# EAGLE design breakout_board (EAGLE 9.5.2)
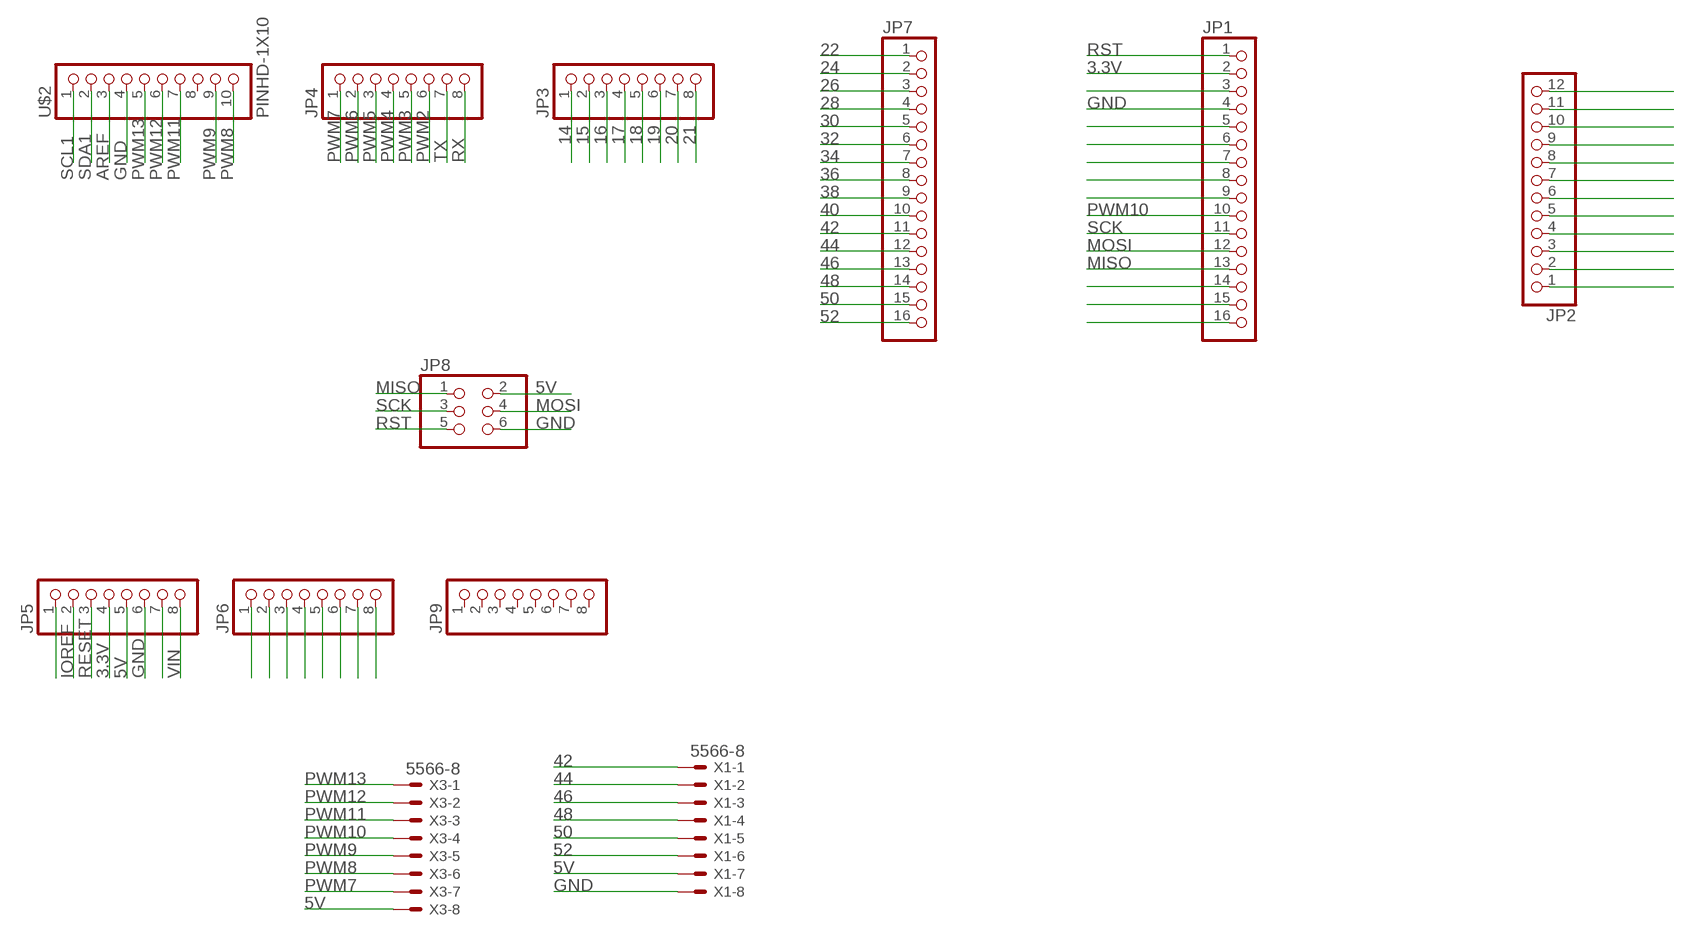
[diagram p0: schematic, sheet 1]

## Parts
JP1  PINHD-1X16  [1X16]
JP2  PINHD-1X12  [1X12]
JP3  PINHD-1X8BIG  [1X08-BIG]
JP4  PINHD-1X8BIG  [1X08-BIG]
JP5  PINHD-1X8BIG  [1X08-BIG]
JP6  PINHD-1X8BIG  [1X08-BIG]
JP7  PINHD-1X16  [1X16]
JP8  PINHD-2X3  [2X03]
JP9  PINHD-1X8BIG  [1X08-BIG]
U$2  PINHD-1X10  [1X10-BIG]
X1  5566-8  [5566-8]
X3  5566-8  [5566-8]

## Nets
3.3V: JP1.2 JP5.4
5V: JP5.5 JP8.2 X1.7 X3.8
14: JP3.1
15: JP3.2
16: JP3.3
17: JP3.4
18: JP3.5
19: JP3.6
20: JP3.7
21: JP3.8
22: JP7.1
24: JP7.2
26: JP7.3
28: JP7.4
30: JP7.5
32: JP7.6
34: JP7.7
36: JP7.8
38: JP7.9
40: JP7.10
42: JP7.11 X1.1
44: JP7.12 X1.2
46: JP7.13 X1.3
48: JP7.14 X1.4
50: JP7.15 X1.5
52: JP7.16 X1.6
AREF: U$2.3
GND: JP1.4 JP5.6 JP8.6 U$2.4 X1.8
IOREF: JP5.2
MISO: JP1.13 JP8.1
MOSI: JP1.12 JP8.4
N$1: JP5.1
N$3: JP2.12
N$4: JP2.11
N$5: JP2.10
N$6: JP2.9
N$7: JP5.7
N$8: JP2.8
N$9: JP6.1
N$10: JP6.2
N$11: JP6.3
N$12: JP6.4
N$13: JP6.5
N$14: JP6.6
N$15: JP6.7
N$16: JP6.8
N$26: JP2.7
N$27: JP2.6
N$28: JP2.5
N$29: JP2.4
N$30: JP2.3
N$31: JP2.2
N$32: JP2.1
N$35: JP1.3
N$37: JP1.5
N$38: JP1.6
N$39: JP1.7
N$40: JP1.8
N$41: JP1.9
N$46: JP1.14
N$47: JP1.15
N$48: JP1.16
PWM2: JP4.6
PWM3: JP4.5
PWM4: JP4.4
PWM5: JP4.3
PWM6: JP4.2
PWM7: JP4.1 X3.7
PWM8: U$2.10 X3.6
PWM9: U$2.9 X3.5
PWM10: JP1.10 X3.4
PWM11: U$2.7 X3.3
PWM12: U$2.6 X3.2
PWM13: U$2.5 X3.1
RESET: JP5.3
RST: JP1.1 JP8.5
RX: JP4.8
SCK: JP1.11 JP8.3
SCL1: U$2.1
SDA1: U$2.2
TX: JP4.7
VIN: JP5.8
Unconnected: JP9.1 JP9.2 JP9.3 JP9.4 JP9.5 JP9.6 JP9.7 JP9.8 U$2.8

## Library data of the parts
JP1 JP7 = pinhead:PINHD-1X16: PIN HEADER
JP2 = pinhead:PINHD-1X12: PIN HEADER
JP3-JP6 JP9 = adafruit:PINHD-1X8: PIN HEADER
JP8 = pinhead:PINHD-2X3: PIN HEADER
U$2 = adafruit:PINHD-1X10: Pin header 1x10 0.1" spacing With round pins
X1 X3 = con-molex:5566-8: Mini FIT connector 8 pol Source: http://www.molex.com; MF: MOLEX; OC_FARNELL: unknown; OC_NEWARK: unknown

## Board
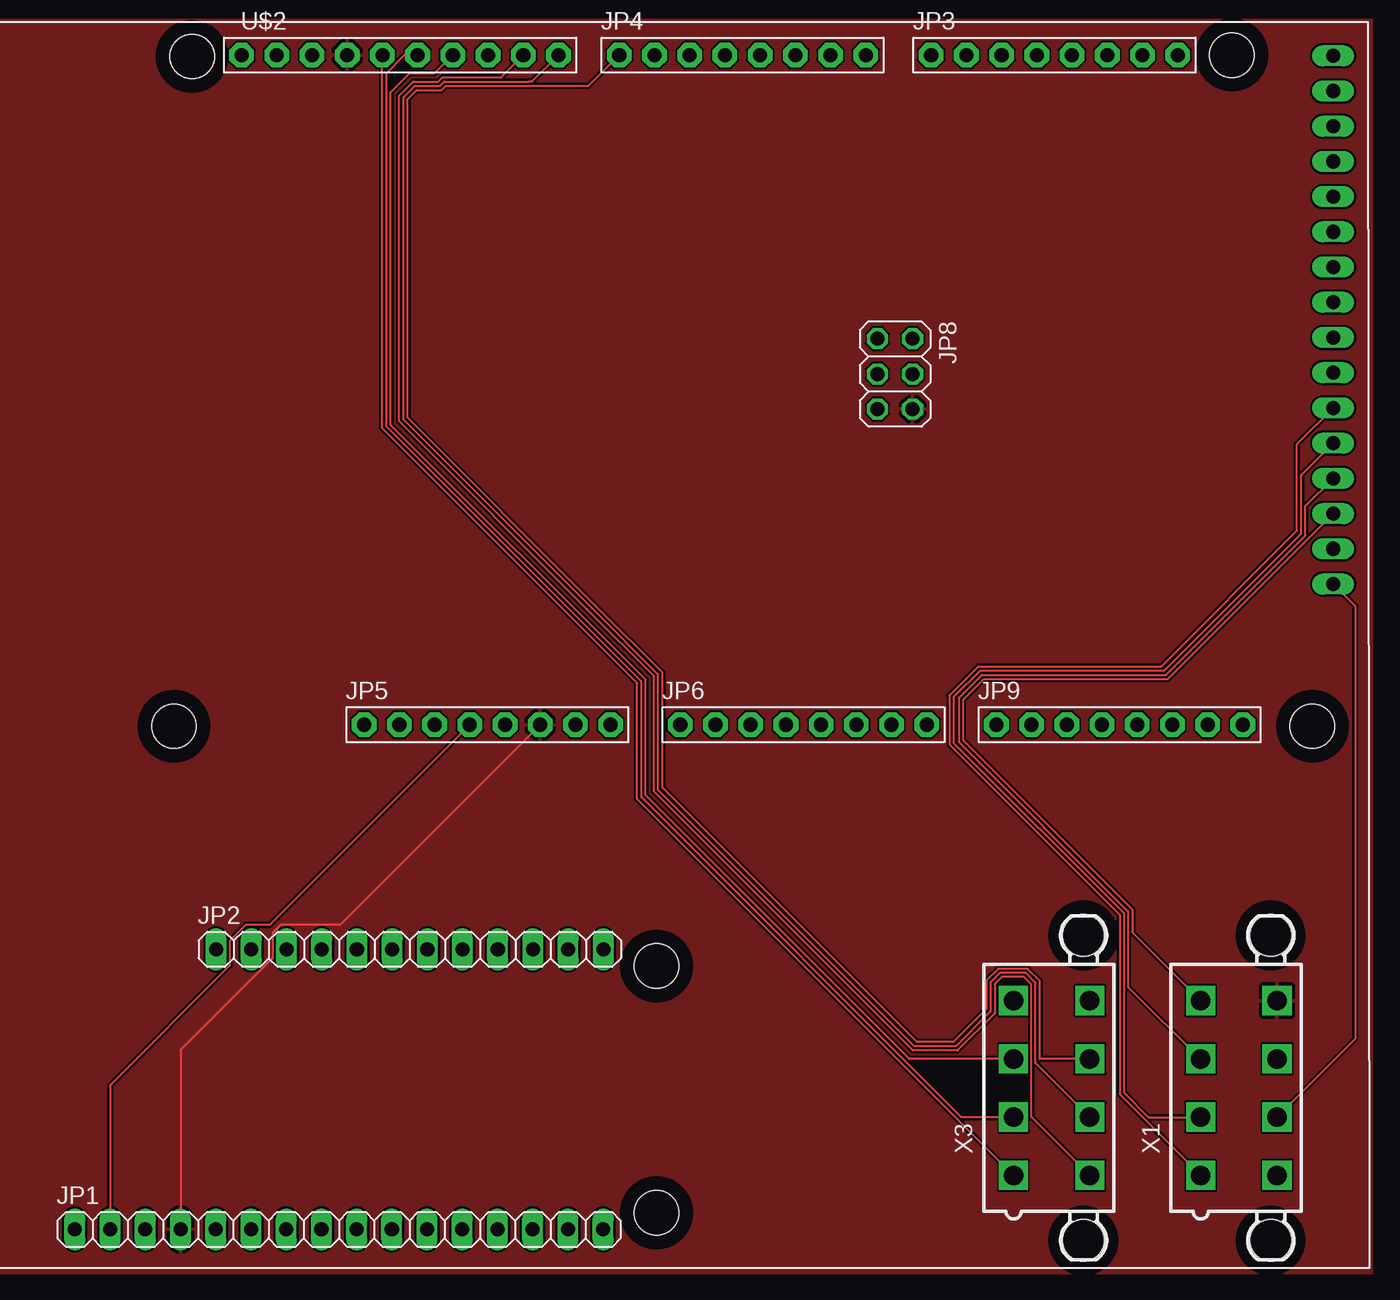
[diagram p1: board, top side]
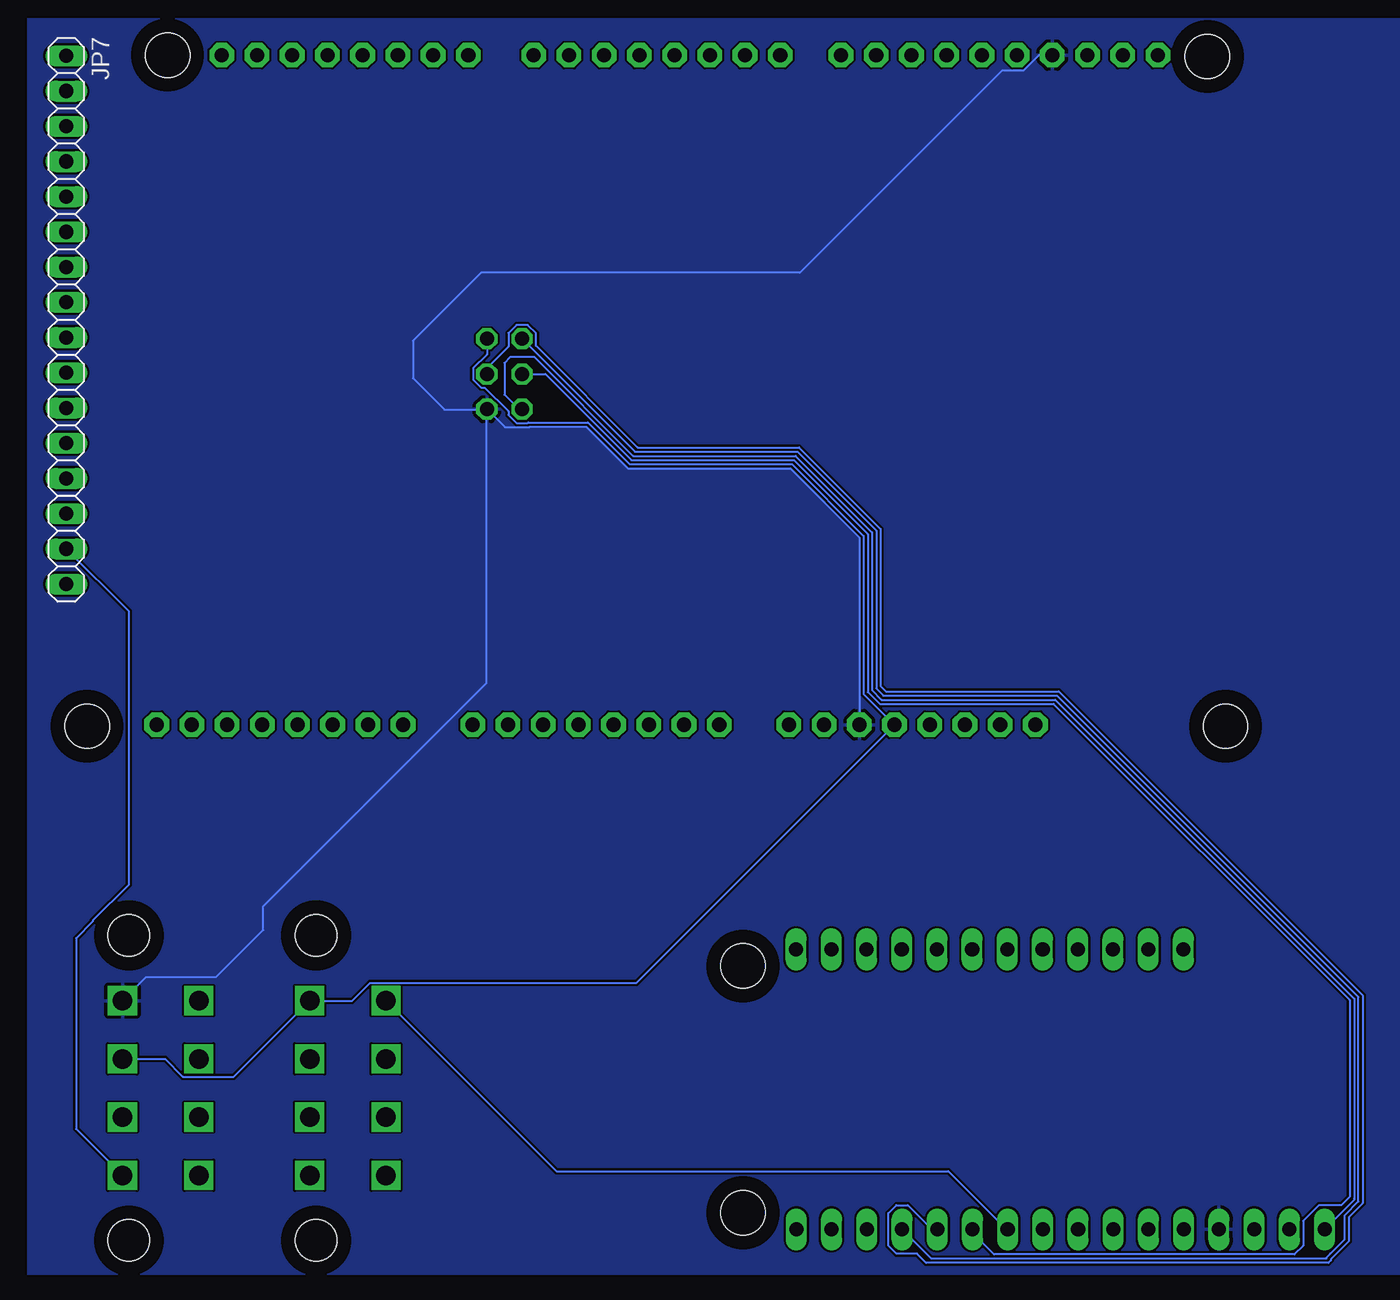
[diagram p2: board, bottom side, seen from below]

No outline drawn. Coordinates in mm, seen from the top.
Copper layers (1*16): Top 0.035mm / dielectric 1.5mm / Bottom 0.035mm
Design rules "default": minimum track width 6mil, minimum drill 0.35mm, track to track 6mil, track to pad 6mil, pad to pad 6mil, via to via 6mil, smd to smd 6mil, copper to edge 40mil, drill to drill 6mil, minimum pad ring 10mil, minimum via ring 8mil, stop-mask expansion 4mil, vias tented up to drill 0mil, thermal gap 10mil
Holes 3.2 mm at 90.2,97.6 15.2,97.5 13.9,49.2 96,49.2 48.7,31.9 48.7,14.1

### Footprints (pad centres in the part's own frame; a part is rotated, then mirrored left to right if it is on the bottom)
1X16 = drill 1.016 long: 1 -19.05,0; 2 -16.51,0; 3 -13.97,0; 4 -11.43,0; 5 -8.89,0; 6 -6.35,0; 7 -3.81,0; 8 -1.27,0; 9 1.27,0; 10 3.81,0; 11 6.35,0; 12 8.89,0; 13 11.43,0; 14 13.97,0; 15 16.51,0; 16 19.05,0
1X12 = drill 1.016 long: 1 -13.97,0; 2 -11.43,0; 3 -8.89,0; 4 -6.35,0; 5 -3.81,0; 6 -1.27,0; 7 1.27,0; 8 3.81,0; 9 6.35,0; 10 8.89,0; 11 11.43,0; 12 13.97,0
1X08-BIG = drill 1.016 pad 1.778 octagon: 1 -8.89,0; 2 -6.35,0; 3 -3.81,0; 4 -1.27,0; 5 1.27,0; 6 3.81,0; 7 6.35,0; 8 8.89,0
2X03 = drill 1.016 octagon: 1 -2.54,-1.27; 2 -2.54,1.27; 3 0,-1.27; 4 0,1.27; 5 2.54,-1.27; 6 2.54,1.27
1X10-BIG = drill 1.016 pad 1.778 octagon: 1 -11.43,0; 2 -8.89,0; 3 -6.35,0; 4 -3.81,0; 5 -1.27,0; 6 1.27,0; 7 3.81,0; 8 6.35,0; 9 8.89,0; 10 11.43,0
5566-8 = drill 1.4 square: 1 6.3,-2.75; 2 2.1,-2.75; 3 -2.1,-2.75; 4 -6.3,-2.75; 5 6.3,2.75; 6 2.1,2.75; 7 -2.1,2.75; 8 -6.3,2.75 | hole 3: 11,2.29; -11,2.29

### Placement (x,y rotation side)
JP1  25.8,12.9 0 top
JP2  30.9,33.1 0 top
JP3  77.4,97.6 0 top
JP4  54.9,97.6 0 top
JP5  36.5,49.3 0 top
JP6  59.3,49.3 0 top
JP7  97.5,78.5 270 bottom
JP8  65.9,74.6 270 top
JP9  82.1,49.3 0 top
U$2  30.2,97.6 0 top
X1  90.7,23.1 270 top
X3  77.2,23.1 270 top

### Tracks (layer width: path | path; a pad name or v marks a point on that pad's centre or on a via)
3.3V
  Top 0.152: JP5.4 20.78,34.85 19.06,34.85 17.92,33.71 17.92,31.93 9.29,23.3 JP1.2
5V
  Bottom 0.152: JP8.2 67.17,76 68.16,75.01 68.16,74.19 67.58,73.61 67.32,73.61 65.62,71.91 65.62,71.65 65.04,71.07 64.22,71.07 64.19,71.1 59.88,71.1 56.87,68.09 45.16,68.09 39.99,62.93 39.99,51.52 JP5.5 56.39,30.68 75.59,30.68 76.87,29.4 X3.8 85.43,23.92 89.09,23.92 90.37,25.2 X1.7
42
  Top 0.152: 69.85,51.45 69.8,51.4 | 69.85,51.45 69.85,47.85 82.1,35.6 82.1,22.65 X1.1 | 69.85,51.45 71.91,53.51 85.11,53.51 94.89,63.29 94.89,69.54 JP7.11
44
  Top 0.152: X1.2 84.18,21 82.41,22.78 82.41,35.73 70.17,47.97 70.17,51.33 72.04,53.21 85.32,53.21 95.19,63.09 95.19,65.2 95.2,65.2 95.2,67.31 JP7.12
46
  Top 0.152: X1.3 87.91,25.2 82.71,30.4 82.71,35.85 70.5,48.06 70.5,51.2 70.5,51.24 72.17,52.91 85.44,52.91 95.5,62.96 95.5,65.07 JP7.13
48
  Top 0.152: 70.81,51.11 70.81,51.1 | 70.81,51.1 70.81,48.2 | 70.81,48.2 70.81,48.19 | 70.81,48.2 83.01,35.99 83.01,34.34 X1.4 | 70.81,51.1 72.31,52.6 85.57,52.6 JP7.14
50
  Top 0.152: 93.4,16.8 X1.5
  Bottom 0.152: JP7.15 93,57.49 93,37.76 95.58,35.17 95.58,35.12 96.8,33.9 96.8,20.15 X1.5
52
  Top 0.152: JP7.16 99.1,57.85 99.1,26.65 X1.6
GND
  Top 0.152: JP5.6 25.86,34.85 21.6,34.85 21.02,34.27 21.02,32.49 14.37,25.84 JP1.4
  Bottom 0.152: X1.8 91.75,31.1 86.7,31.1 83.3,34.5 83.3,36.2 67.2,52.3 67.2,72.03 | 67.2,72.03 JP8.6 65.88,70.77 64.09,70.77 64.06,70.79 60.01,70.79 56.99,67.78 45.28,67.78 40.3,62.8 JP5.6 | U$2.4 27.35,97.6 28.47,96.48 30.02,96.48 44.6,81.9 67.6,81.9 72.5,77 72.5,74.3 70.23,72.03 67.2,72.03
  pour Top: -0.3,100.2 100.3,100.2 100.3,9.7 -0.3,9.7
  pour Bottom: -0.3,100.2 100.3,100.2 100.3,9.7 -0.3,9.7
MISO
  Bottom 0.152: JP8.1 56.49,69 44.78,69 39.08,63.3 39.08,51.92 38.57,51.41 26.05,51.41 4.3,29.67 4.3,14.91 5.3,13.92 5.3,12.19 6.34,11.15 6.35,11.15 6.7,10.79 | 37.1,12.9 JP1.13 35.12,10.79 6.7,10.79 | 6.61,10.79 6.7,10.79
MOSI
  Bottom 0.152: JP8.4 67.17,75.03 65.62,76.58 65.62,77.55 65.04,78.13 64.22,78.13 63.64,77.55 63.64,76.64 56.3,69.31 44.65,69.31 38.78,63.43 38.78,52.09 38.4,51.71 25.92,51.71 4,29.79 4,14.79 5,13.79 5,12.06 6.3,10.76 6.3,10.67 6.48,10.49 35.49,10.49 36.15,11.15 37.64,11.15 38.22,11.73 38.22,14.07 37.64,14.65 36.82,14.65 35.07,12.9 34.9,12.9 JP1.12
PWM7
  Top 0.152: X3.7 76.34,25.2 76.34,30.82 75.45,31.71 73.35,31.71 72.49,30.85 72.49,28.8 70.11,26.42 67.48,26.42 49.13,44.77 49.13,53.06 44.31,57.87 44.31,57.88 30.75,71.44 30.75,94.43 31.41,95.08 33.22,95.08 33.52,95.39 39.85,95.39 39.86,95.4 43.81,95.4 JP4.1
PWM8
  Top 0.152: X3.6 76.03,24.92 76.03,30.7 75.33,31.41 73.47,31.41 72.8,30.73 72.8,28.63 70.28,26.11 67.32,26.11 48.82,44.61 48.82,52.93 44.01,57.75 30.45,71.32 30.45,94.55 31.28,95.39 33.09,95.39 33.39,95.69 39.49,95.69 39.5,95.7 39.73,95.7 U$2.10
PWM9
  Top 0.152: X3.5 75.73,21.02 75.73,30.57 75.2,31.1 73.6,31.1 73.1,30.6 73.1,28.5 70.41,25.81 67.19,25.81 48.52,44.48 48.52,52.8 43.7,57.62 43.7,57.63 30.14,71.19 30.14,94.68 31.15,95.69 32.96,95.69 33.27,96 35.4,96 | 35.4,96 | 35.4,96 36.4,96 37.49,96 U$2.9
PWM10
  Bottom 0.152: X3.4 62.15,17.1 33.9,17.1 29.7,12.9 JP1.10
PWM11
  Top 0.152: X3.3 66.93,25.2 47.91,44.22 47.91,52.55 29.53,70.93 29.53,94.93 30.9,96.3 32.71,96.3 U$2.7
PWM12
  Top 0.152: X3.2 70.7,21 47.8,43.9 47.78,43.9 47.6,44.08 47.6,52.43 29.22,70.81 29.22,96.31 30.51,97.6 U$2.6
PWM13
  Top 0.152: X3.1 47.3,43.95 47.3,52.3 28.91,70.69 28.91,97.58 | 28.9,97.57 28.91,97.58 | 28.91,97.58 U$2.5
RST
  Bottom 0.152: JP1.1 4.62,15.03 | 4.62,15.03 4.61,15.04 | JP8.5 64.86,72.06 65.9,73.1 65.9,75.4 65.5,75.8 63.72,75.8 56.62,68.69 44.9,68.69 39.39,63.18 39.39,51.79 38.7,51.1 26.17,51.1 4.61,29.54 4.61,28.3 4.61,28.2 4.61,15.16 4.62,15.14 4.62,15.03
SCK
  Bottom 0.152: JP8.3 62.95,74.6 56.74,68.39 45.03,68.39 39.69,63.05 39.69,51.65 38.84,50.8 26.3,50.8 4.95,29.45 4.95,15.25 | 4.91,15.29 4.95,15.25 | 4.95,15.25 5.55,14.65 7.16,14.65 8.3,13.51 8.3,11.73 8.93,11.1 30.6,11.1 32.15,12.65 JP1.11